# EAGLE design UVA Module (EAGLE 9.4.2)
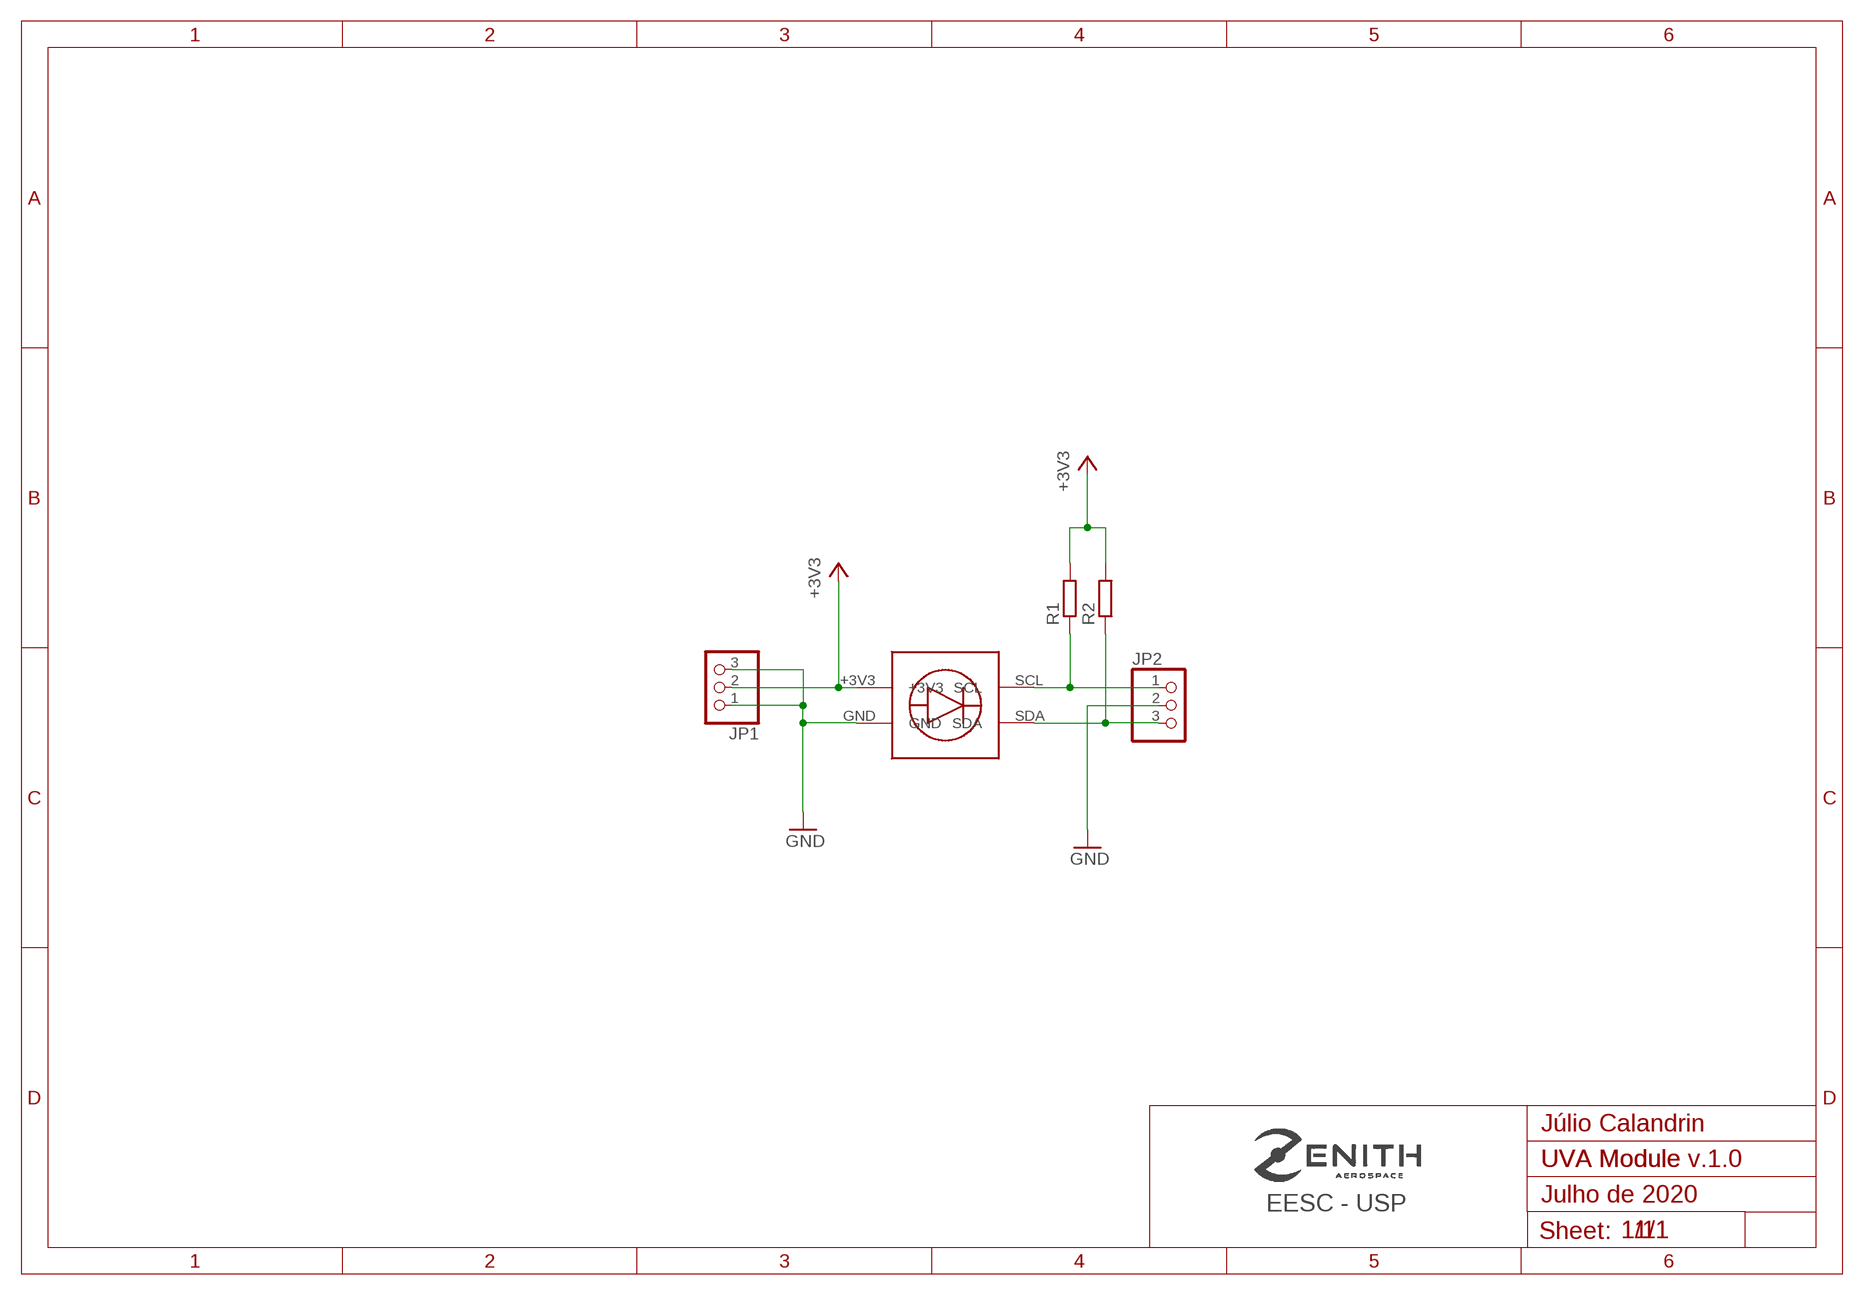
[diagram p0: schematic, sheet 1]

## Parts
JP1  PINHD-1X3  [1X03]
JP2  PINHD-1X3  [1X03]
R1  R-EU_R0805  [R0805]
R2  R-EU_R0805  [R0805]
U$1  BREAKOUT_UV-A  [PADS_UV-A/B]

## Nets
+3V3: JP1.2 R1.2 R2.2 U$1.+3V3
GND: JP1.1 JP1.3 JP2.2 U$1.GND
N$4: JP2.3 R2.1 U$1.SDA
N$5: JP2.1 R1.1 U$1.SCL

## Notes on the sheet
- Júlio Calandrin
- UVA Module v.1.0
- EESC - USP | Julho de 2020
- 1/1

## Library data of the parts
JP1 JP2 = pinhead(1x3):PINHD-1X3: PIN HEADER
R1 R2 = rcl:R-EU_: RESISTOR, European symbol; SPICEPREFIX: R
U$1 = Zenith_Breakouts:BREAKOUT_UV-A

## Board
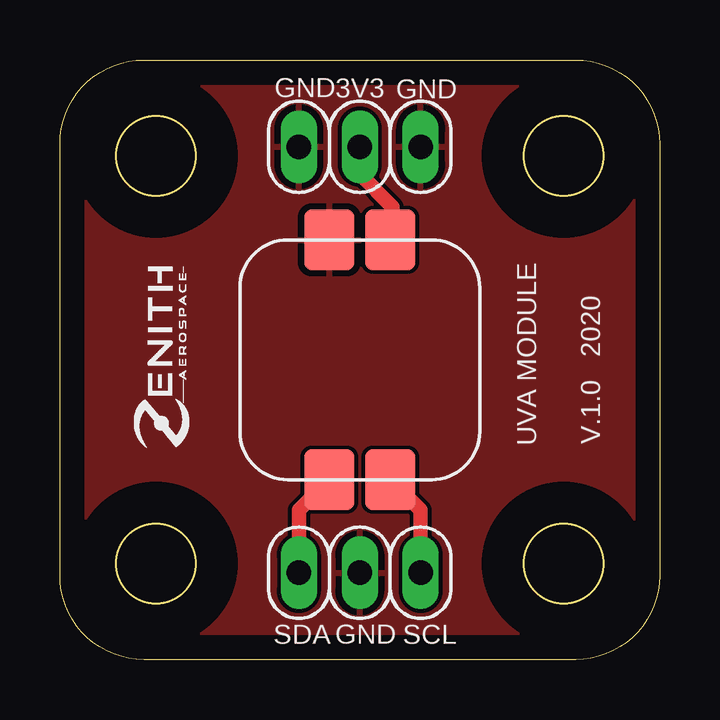
[diagram p1: board, top side]
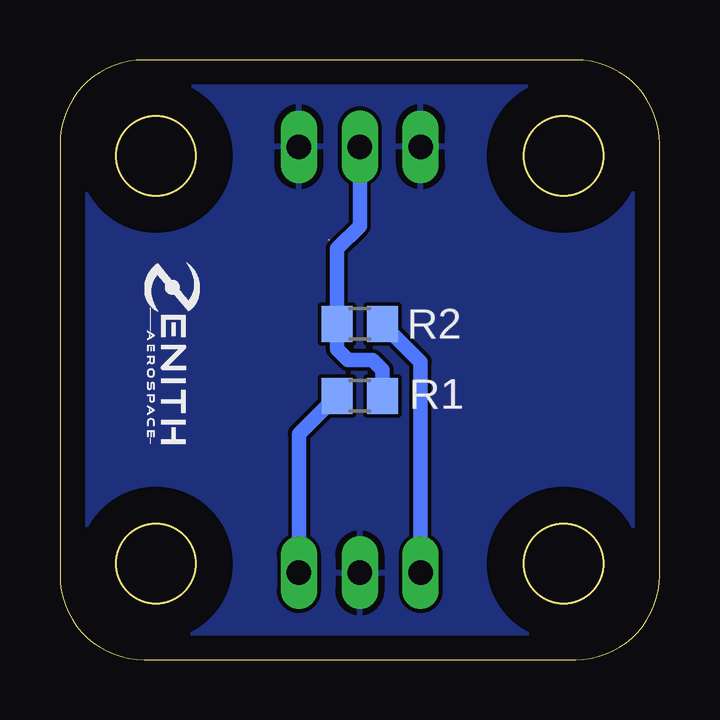
[diagram p2: board, bottom side, seen from below]

Size 25 x 25 mm. Coordinates in mm from the lower left corner, seen from the top.
Outline: 0,3.5 0,21.5 arc-90 3.5,25 21.5,25 arc-90 25,21.5 25,3.5 arc-90 21.5,0 3.5,0 arc-90 0,3.5
Outline: circle at 4,21 radius 1.65
Outline: circle at 21,21 radius 1.65
Outline: circle at 4,4 radius 1.65
Outline: circle at 21,4 radius 1.65
Copper layers (1*16): Top 0.035mm / dielectric 1.5mm / Bottom 0.035mm
Design rules "default": minimum track width 6mil, minimum drill 0.35mm, track to track 6mil, track to pad 6mil, pad to pad 6mil, via to via 6mil, smd to smd 6mil, copper to edge 40mil, drill to drill 6mil, minimum pad ring 10mil, minimum via ring 8mil, stop-mask expansion 4mil, vias tented up to drill 0mil, thermal gap 10mil
tRestrict: area 0.8,17.8 to 7.2,24.2; area 17.8,17.8 to 24.2,24.2; area 0.8,0.8 to 7.2,7.2; area 17.8,0.8 to 24.2,7.2
bRestrict: area 1,18 to 7,24; area 18,18 to 24,24; area 18,1 to 24,7; area 1,1 to 7,7

### Footprints (pad centres in the part's own frame; a part is rotated, then mirrored left to right if it is on the bottom)
1X03 = drill 1.016 long: 1 -2.54,0; 2 0,0; 3 2.54,0
R0805 = smd 1.3 x 1.5: 1 -0.95,0; 2 0.95,0
PADS_UV-A/B = smd 2.54 x 2.1: +3V3 -5,1.27; GND -5,-1.27; SCL 5,1.27; SDA 5,-1.27

### Placement (x,y rotation side)
JP1  12.5,21.38 0 top
JP2  12.5,3.62 180 top
R1  12.5,11 0 bottom
R2  12.5,14 180 bottom
U$1  12.5,12.5 270 top

### Tracks (layer width: path | path; a pad name or v marks a point on that pad's centre or on a via)
+3V3  (1 unrouted)
  Top 0.508: 14.5,17.5 13.8,17.5
  Top 0.61: JP1.2 12.5,20.23 13.87,18.86 13.87,17.6 U$1.+3V3
  Bottom 0.61: R1.2 11.55,12.07 11.96,12.48 12.98,12.48 13.45,12.95 R2.2 13.45,17.13 12.5,18.08 JP1.2
  Bottom 0.813: 13.5,14.05 R2.2
GND
  pour Top: -0.46,25.5 25.5,25.5 25.5,-0.5 -0.46,-0.5
  pour Bottom: -0.42,25.5 -0.42,-0.5 25.5,-0.5 25.5,25.5
N$4
  Top 0.61: U$1.SDA 9.96,6.23 JP2.3 9.96,6.04
  Bottom 0.61: JP2.3 9.96,12.41 R2.1
N$5
  Top 0.61: U$1.SCL 15.04,6.23 JP2.1 15.04,6.04
  Bottom 0.61: R1.1 15.04,9.41 JP2.1

### Text on the board
tNames: GND | 3V3 | GND | UVA MODULE | V.1.0 2020 | SDA | GND | SCL
bNames: D:/Zenith/Logo-bitmap-invertido.bmp